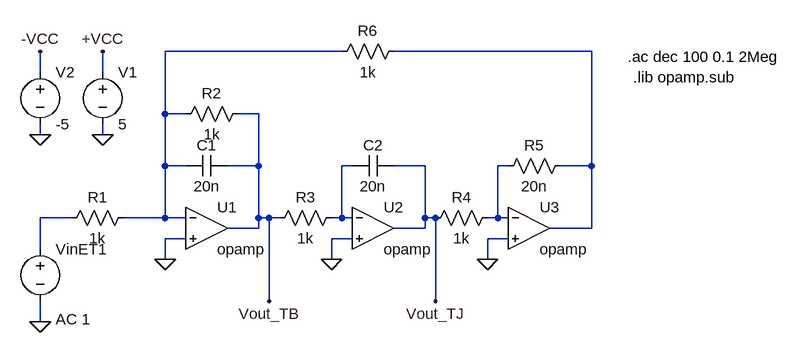
[diagram p0: schematic Etaj2_Ideal.asc]
Etaj2_Ideal.asc, the LTspice schematic file:
Version 4.1
SHEET 1 880 680
WIRE 128 -80 -144 -80
WIRE 512 -80 208 -80
WIRE -336 -48 -336 -80
WIRE -240 -48 -240 -80
WIRE -144 16 -144 -80
WIRE -112 16 -144 16
WIRE 0 16 -32 16
WIRE -336 48 -336 32
WIRE -240 48 -240 32
WIRE -144 96 -144 16
WIRE -112 96 -144 96
WIRE 0 96 0 16
WIRE 0 96 -48 96
WIRE 144 96 128 96
WIRE 256 96 208 96
WIRE 384 96 368 96
WIRE 512 96 512 -80
WIRE 512 96 464 96
WIRE -288 176 -336 176
WIRE -144 176 -144 96
WIRE -144 176 -208 176
WIRE -112 176 -144 176
WIRE 0 176 0 96
WIRE 16 176 0 176
WIRE 32 176 16 176
WIRE 128 176 128 96
WIRE 128 176 112 176
WIRE 144 176 128 176
WIRE 256 176 256 96
WIRE 272 176 256 176
WIRE 368 176 368 96
WIRE 368 176 352 176
WIRE 384 176 368 176
WIRE 0 192 0 176
WIRE 0 192 -48 192
WIRE 256 192 256 176
WIRE 256 192 208 192
WIRE 512 192 512 96
WIRE 512 192 448 192
WIRE -112 208 -144 208
WIRE 144 208 112 208
WIRE 384 208 352 208
WIRE -336 224 -336 176
WIRE -144 240 -144 208
WIRE 112 240 112 208
WIRE 352 240 352 208
WIRE 16 304 16 176
WIRE 272 304 272 176
WIRE -336 336 -336 304
FLAG -144 240 0
FLAG 112 240 0
FLAG 352 240 0
FLAG -336 48 0
FLAG -240 48 0
FLAG -240 -80 +VCC
FLAG -336 -80 -VCC
FLAG -336 336 0
FLAG 16 304 Vout_TB
FLAG 272 304 Vout_TJ
SYMBOL res -192 160 R90
WINDOW 0 0 56 VBottom 2
WINDOW 3 32 56 VTop 2
SYMATTR InstName R1
SYMATTR Value 1k
SYMBOL cap -48 80 R90
WINDOW 0 0 32 VBottom 2
WINDOW 3 32 32 VTop 2
SYMATTR InstName C1
SYMATTR Value 20n
SYMBOL res -16 0 R90
WINDOW 0 0 56 VBottom 2
WINDOW 3 32 56 VTop 2
SYMATTR InstName R2
SYMATTR Value 1k
SYMBOL res 128 160 R90
WINDOW 0 0 56 VBottom 2
WINDOW 3 32 56 VTop 2
SYMATTR InstName R3
SYMATTR Value 1k
SYMBOL cap 208 80 R90
WINDOW 0 0 32 VBottom 2
WINDOW 3 32 32 VTop 2
SYMATTR InstName C2
SYMATTR Value 20n
SYMBOL res 368 160 R90
WINDOW 0 0 56 VBottom 2
WINDOW 3 32 56 VTop 2
SYMATTR InstName R4
SYMATTR Value 1k
SYMBOL res 480 80 R90
WINDOW 0 0 56 VBottom 2
WINDOW 3 32 56 VTop 2
SYMATTR InstName R5
SYMATTR Value 20n
SYMBOL res 224 -96 R90
WINDOW 0 0 56 VBottom 2
WINDOW 3 32 56 VTop 2
SYMATTR InstName R6
SYMATTR Value 1k
SYMBOL voltage -240 -64 R0
SYMATTR InstName V1
SYMATTR Value 5
SYMBOL voltage -336 -64 R0
SYMATTR InstName V2
SYMATTR Value -5
SYMBOL voltage -336 208 R0
WINDOW 123 24 124 Left 2
WINDOW 39 0 0 Left 0
SYMATTR Value2 AC 1
SYMATTR InstName VinET1
SYMATTR Value ""
SYMBOL OpAmps\\opamp -80 128 R0
SYMATTR InstName U1
SYMBOL OpAmps\\opamp 176 128 R0
SYMATTR InstName U2
SYMBOL OpAmps\\opamp 416 128 R0
SYMATTR InstName U3
TEXT 568 -72 Left 2 !.ac dec 100 0.1 2Meg
TEXT 576 -40 Left 2 !.lib opamp.sub

The netlist it stands for:
* Etaj2_Ideal.asc
R1 N001 N005 1k
C1 Vout_TB N001 20n
R2 Vout_TB N001 1k
R3 N003 Vout_TB 1k
C2 Vout_TJ N003 20n
R4 N004 Vout_TJ 1k
R5 N002 N004 20n
R6 N002 N001 1k
V1 +VCC 0 5
V2 -VCC 0 -5
VinET1 N005 0 AC 1
X§U1 N001 0 Vout_TB opamp Aol=100K GBW=10Meg  ; pins invin noninvin out
X§U2 N003 0 Vout_TJ opamp Aol=100K GBW=10Meg  ; pins invin noninvin out
X§U3 N004 0 N002 opamp Aol=100K GBW=10Meg  ; pins invin noninvin out
.ac dec 100 0.1 2Meg
.lib opamp.sub
.backanno
.end